# Altium schematic sheet Digital Port F Button.SchDoc: PORT State Change Buttons
size A4
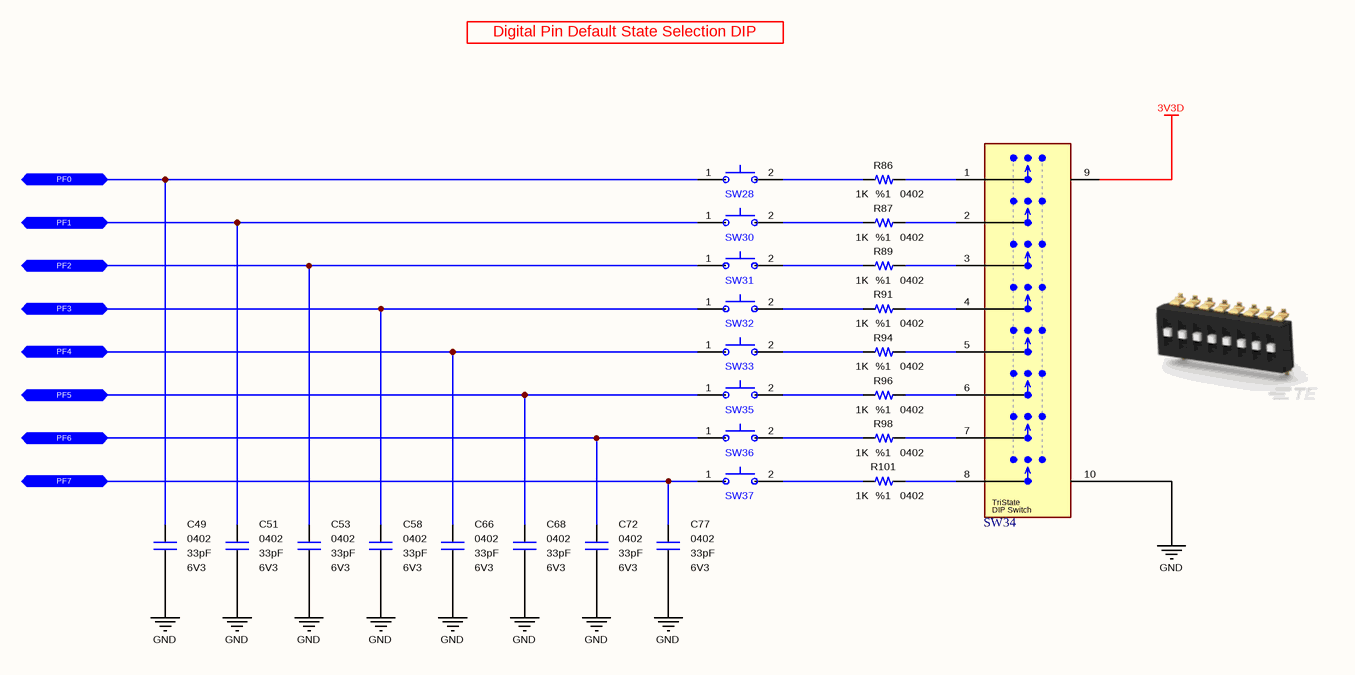
[diagram p0: Digital Port F Button.SchDoc]

## Parts
C49  value 33pF  Case: 0402  Voltage: 6V3  [CAPACITOR_0402]  (hidden comment: Multilayer Ceramic Capacitor)
C51  value 33pF  Case: 0402  Voltage: 6V3  [CAPACITOR_0402]  (hidden comment: Multilayer Ceramic Capacitor)
C53  value 33pF  Case: 0402  Voltage: 6V3  [CAPACITOR_0402]  (hidden comment: Multilayer Ceramic Capacitor)
C58  value 33pF  Case: 0402  Voltage: 6V3  [CAPACITOR_0402]  (hidden comment: Multilayer Ceramic Capacitor)
C66  value 33pF  Case: 0402  Voltage: 6V3  [CAPACITOR_0402]  (hidden comment: Multilayer Ceramic Capacitor)
C68  value 33pF  Case: 0402  Voltage: 6V3  [CAPACITOR_0402]  (hidden comment: Multilayer Ceramic Capacitor)
C72  value 33pF  Case: 0402  Voltage: 6V3  [CAPACITOR_0402]  (hidden comment: Multilayer Ceramic Capacitor)
C77  value 33pF  Case: 0402  Voltage: 6V3  [CAPACITOR_0402]  (hidden comment: Multilayer Ceramic Capacitor)
R86  value 1K  Tolerance: %1  Case: 0402  [RESISTOR_0402]  (hidden comment: Thick Film Resistor)
R87  value 1K  Tolerance: %1  Case: 0402  [RESISTOR_0402]  (hidden comment: Thick Film Resistor)
R89  value 1K  Tolerance: %1  Case: 0402  [RESISTOR_0402]  (hidden comment: Thick Film Resistor)
R91  value 1K  Tolerance: %1  Case: 0402  [RESISTOR_0402]  (hidden comment: Thick Film Resistor)
R94  value 1K  Tolerance: %1  Case: 0402  [RESISTOR_0402]  (hidden comment: Thick Film Resistor)
R96  value 1K  Tolerance: %1  Case: 0402  [RESISTOR_0402]  (hidden comment: Thick Film Resistor)
R98  value 1K  Tolerance: %1  Case: 0402  [RESISTOR_0402]  (hidden comment: Thick Film Resistor)
R101  value 1K  Tolerance: %1  Case: 0402  [RESISTOR_0402]  (hidden comment: Thick Film Resistor)
SW28  Tactile Switches  [PTS526_Switch]  (value not drawn)
SW30  Tactile Switches  [PTS526_Switch]  (value not drawn)
SW31  Tactile Switches  [PTS526_Switch]  (value not drawn)
SW32  Tactile Switches  [PTS526_Switch]  (value not drawn)
SW33  Tactile Switches  [PTS526_Switch]  (value not drawn)
SW34  DIP Switches/SIP Switches  [TDS08SGNNTR04]  (value not drawn)
SW35  Tactile Switches  [PTS526_Switch]  (value not drawn)
SW36  Tactile Switches  [PTS526_Switch]  (value not drawn)
SW37  Tactile Switches  [PTS526_Switch]  (value not drawn)

## Ports
PF0 (bidir), PF1 (bidir), PF2 (bidir), PF3 (bidir), PF4 (bidir), PF5 (bidir), PF6 (bidir), PF7 (bidir)

## Nets
3V3D: SW34.9(VCC)
GND: C49.1 C51.1 C53.1 C58.1 C66.1 C68.1 C72.1 C77.1 SW34.10(GND)
PF0: C49.2 SW28.1(NC) ; port PF0
PF1: C51.2 SW30.1(NC) ; port PF1
PF2: C53.2 SW31.1(NC) ; port PF2
PF3: C58.2 SW32.1(NC) ; port PF3
PF4: C66.2 SW33.1(NC) ; port PF4
PF5: C68.2 SW35.1(NC) ; port PF5
PF6: C72.2 SW36.1(NC) ; port PF6
PF7: C77.2 SW37.1(NC) ; port PF7
NetR86_1: R86.1 SW34.1
NetR86_2: R86.2 SW28.2(COM)
NetR87_1: R87.1 SW34.2
NetR87_2: R87.2 SW30.2(COM)
NetR89_1: R89.1 SW34.3
NetR89_2: R89.2 SW31.2(COM)
NetR91_1: R91.1 SW34.4
NetR91_2: R91.2 SW32.2(COM)
NetR94_1: R94.1 SW34.5
NetR94_2: R94.2 SW33.2(COM)
NetR96_1: R96.1 SW34.6
NetR96_2: R96.2 SW35.2(COM)
NetR98_1: R98.1 SW34.7
NetR98_2: R98.2 SW36.2(COM)
NetR101_1: R101.1 SW34.8
NetR101_2: R101.2 SW37.2(COM)

## Notes on the sheet
- Digital Pin Default State Selection DIP
- Title
- Size:
- Date:
- A4
- Number:
- Time:
- Revision:
- Sheet
- of
- File:
- (in symbol Switch - DIP Switch (8 Pole TriState)) TriState; DIP Switch

## Library data of the parts
C49 C51 C53 C58 C66 C68 C72 C77 = Capacitor - 33pF [0402-6V3]: Capacitor - 33pF [0402] (Ceramic); Manufacturer Name: Kemet; Manufacturer Part Number: C0402C330J9RACAUTO; Dielectric: X7R; Tolerance: 10%; Height: 0.5mm; Mouser Part Number: 80-C0402C330J9RAUTO; Maximum Operating Temperature: +125; Minimum Operating Temperature: -55; ROHS: Yes; ComponentLink1Description: DataSheet; ComponentLink1URL: https://api.kemet.com/component-edge/download/datasheet/C0402C330J9RACAUTO.pdf; ComponentLink2Description: Mouser; ComponentLink2URL: https://www.mouser.com/Search/Refine.aspx?Keyword=80-C0402C330J9RAUTO; Supplier 1: Mouser; Supplier Part Number 1: 80-C0402C330J9RAUTO
R86 R87 R89 R91 R94 R96 R98 R101 = Resistor - 1K: Thick Film Resistors - SMD 1/16 W 1.0 Kohms 1%; Manufacturer Name: Vishay; Manufacturer Part Number: CRCW04021K00FKED; Height: 0.35mm; Mouser Part Number: 71-CRCW0402-1.0K-E3; ComponentLink1Description: DataSheet; ComponentLink1URL: https://www.mouser.com.tr/datasheet/2/427/dcrcwe3-1762152.pdf; ComponentLink2Description: Mouser; ComponentLink2URL: https://www.mouser.com.tr/ProductDetail/Vishay-Dale/CRCW04021K00FKED?qs=sGAEpiMZZMu61qfTUdNhG2DpbjADlD3GFJ4zSbeLqG8%3D; Supplier 1: Mouser; Supplier 2: Digi-Key; Supplier Part Number 1: 71-CRCW0402-1.0K-E3; Supplier Part Number 2: 541-1.00KLCT-ND
SW28 SW30-SW33 SW35-SW37 = Switch - Tactile: Tactile Switches 50mA 12VDC, 5.2x5.2mm, 0.8mm H, 260gf, G leads.; Manufacturer Name: C&K Switches; Manufacturer Part Number: PTS526 SK08 SMTR2 LFS; Height: 0.8mm; Mouser Part Number: 611-PTS526SK08SMTR2L; ComponentLink1Description: DataSheet; ComponentLink1URL: https://eu.mouser.com/datasheet/2/60/pts526-1651200.pdf; ComponentLink2Description: Mouser; ComponentLink2URL: https://eu.mouser.com/ProductDetail/CK/PTS526-SK08-SMTR2-LFS?qs=sGAEpiMZZMsgGjVA3toVBL%2FRce%252ByN3s1hQPqiLlQ%252BeM%3D; Supplier 1: Future Electronics; Supplier 2: Mouser; Supplier 3: Arrow; Supplier 4: Digi-Key; Supplier Part Number 1: PTS526SK08SMTR2LFS-REEL; Supplier Part Number 2: 611-PTS526SK08SMTR2L; Supplier Part Number 3: PTS526 SK08 SMTR2 LFS; Supplier Part Number 4: CKN12219-1-ND
SW34 = Switch - DIP Switch (8 Pole TriState): DIP Switches/SIP Switches TRI-STATE DIP 8P G RAISED T&R; Manufacturer Name: TE Connectivity; Manufacturer Part Number: TDS08SGNNTR04; Mouser Part Number: 506-TDS08SGNNTR04; ComponentLink1Description: DataSheet; ComponentLink1URL: https://www.mouser.com.tr/datasheet/2/418/4/NG_DS_1-1773931-8_ALCOSWITCH_DIP_TDS_0917-1221113.pdf; ComponentLink2Description: Mouser; ComponentLink2URL: https://www.mouser.com.tr/ProductDetail/TE-Connectivity-Alcoswitch/TDS08SGNNTR04/?qs=wd5RIQLrsJiLOOX2pWoyQw==